# EAGLE design simon-7segment (EAGLE 7.6.0)
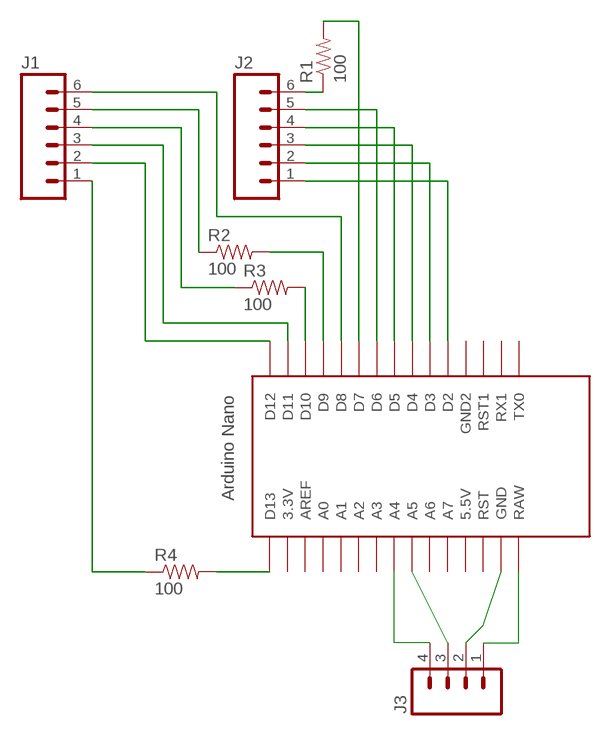
[diagram p0: schematic, sheet 1]

## Parts
J1  M06SILK_FEMALE_PTH  [1X06]
J2  M06SILK_FEMALE_PTH  [1X06]
J3  M04LOCK_LONGPADS  [1X04_LOCK_LONGPADS]
R1  100  RESISTORPTH-1/4W  [AXIAL-0.4]
R2  100  RESISTORPTH-1/4W  [AXIAL-0.4]
R3  100  RESISTORPTH-1/4W  [AXIAL-0.4]
R4  100  RESISTORPTH-1/4W  [AXIAL-0.4]
U$1  NANO  [NANO]

## Nets
5V: J3.1 U$1.RAW
12: J1.1 R4.P$1
GND: J3.2 U$1.GND
N$1: J2.1 U$1.D2
N$2: J2.2 U$1.D3
N$3: J2.3 U$1.D4
N$4: J2.4 U$1.D5
N$5: J2.5 U$1.D6
N$6: J2.6 R1.P$1
N$7: R1.P$2 U$1.D7
N$8: J1.6 U$1.D8
N$9: J1.5 R2.P$1
N$10: R2.P$2 U$1.D9
N$11: J1.4 R3.P$1
N$12: R3.P$2 U$1.D10
N$13: J1.3 U$1.D11
N$14: J1.2 U$1.D12
N$16: R4.P$2 U$1.D13
SCL: J3.3 U$1.A5
SDA: J3.4 U$1.A4
Unconnected: U$1.3.3V U$1.5V(5.5V) U$1.A0 U$1.A1 U$1.A2 U$1.A3 U$1.A6 U$1.A7 U$1.AREF U$1.GND1(GND2) U$1.ICSP1 U$1.ICSP2 U$1.ICSP3 U$1.ICSP4 U$1.ICSP5 U$1.ICSP6 U$1.RST U$1.RST1 U$1.RX1 U$1.TX0

## Library data of the parts
J1 J2 = SparkFun-Connectors:M06: Header 6 Standard 6-pin 0.1" header. Use with straight break away headers (SKU : PRT-00116), right angle break away headers (PRT-00553), swiss pins (PRT-00743), machine pins (PRT-00117), and female headers (PRT-00115). Molex polarized connector foot print use with SKU : PRT-08094 with associated crimp pins and housings. NOTES ON THE VARIANTS LOCK and LOCK_LONGPADS... This footprint was designed to help hold the alignment of a through-hole component (i.e. 6-pin header) while soldering it into place. You may notice that each hole has been shifted either up or down by 0.005 of an inch from it's more standard position (which is a perfectly straight line). This slight alteration caused the pins (the squares in the middle) to touch the edges of the holes. Because they are alternating, it causes a "brace" to hold the component in place. 0.005 has proven to be the perfect amount of "off-center" position when using our standard breakaway headers. Although looks a little odd when you look at the bare footprint, once you have a header in there, the alteration is very hard to notice. Also,if you push a header all the way into place, it is covered up entirely on the bottom side. This idea of altering the position of holes to aid alignment will be further integrated into the Sparkfun Library for other footprints. It can help hold any component with 3 or more connection pins.; PROD_ID: CONN-08437
J3 = SparkFun-Connectors:M04: Header 4 Standard 4-pin 0.1" header. Use with straight break away headers (SKU : PRT-00116), right angle break away headers (PRT-00553), swiss pins (PRT-00743), machine pins (PRT-00117), and female headers (PRT-00115). Molex polarized connector foot print use with SKU : PRT-08231 with associated crimp pins and housings. 1MM SMD Version SKU: PRT-10208; PROD_ID: CONN-09696
R1-R4 = SparkFun-Passives:RESISTOR: Resistor Basic schematic elements and footprints for 0603, 1206, and PTH resistors.
U$1 = Arduino-clone:NANO: Arduino Nano

## Board
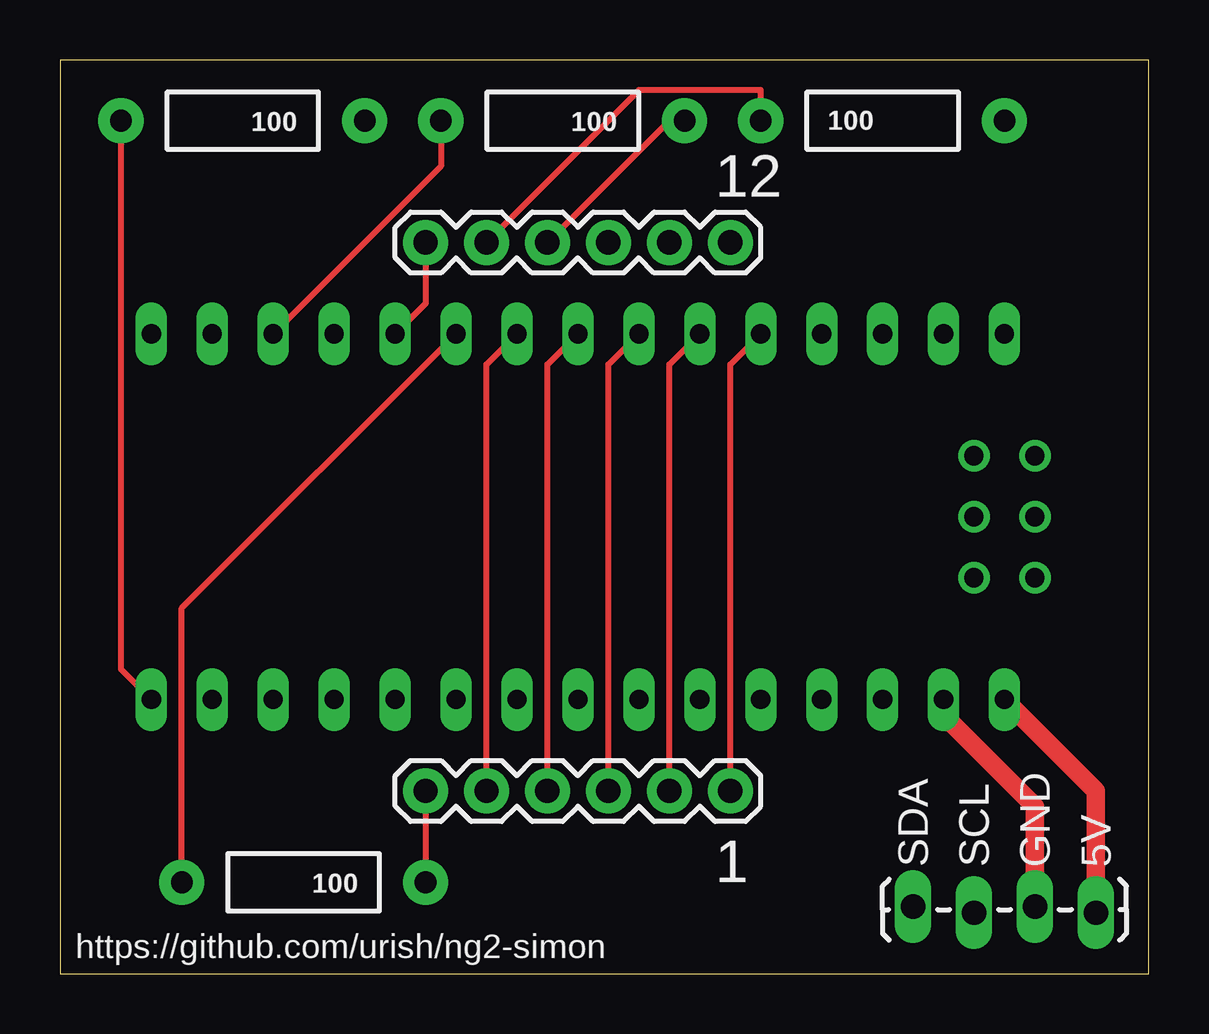
[diagram p1: board, top side]
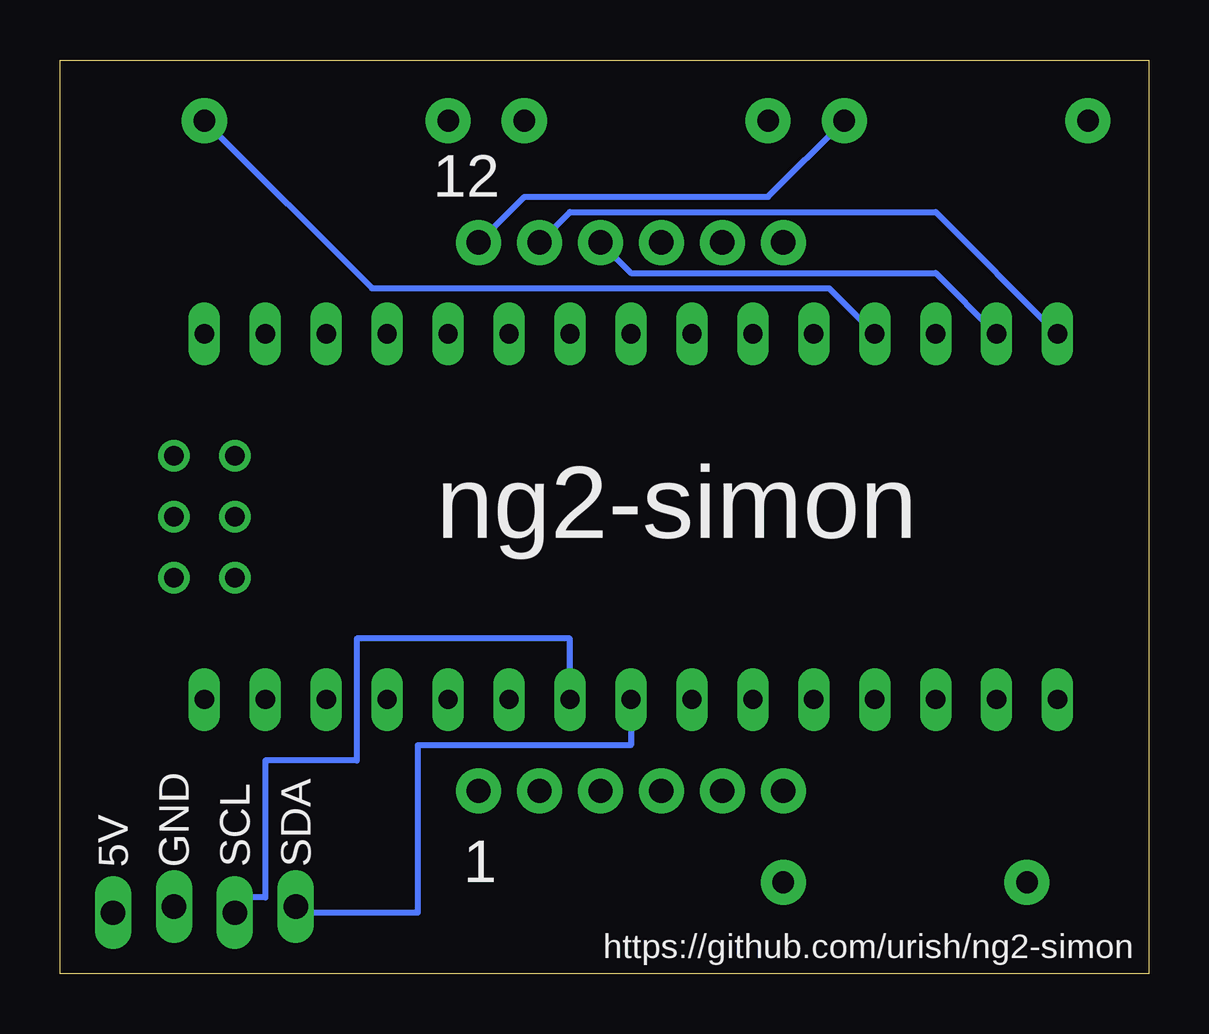
[diagram p2: board, bottom side, seen from below]

Size 45.39 x 38.09 mm. Coordinates in mm from the lower left corner, seen from the top.
Outline: 0,0 45.39,0 45.39,38.09 0,38.09 0,0
Copper layers (1*16): Top 0.035mm / dielectric 1.5mm / Bottom 0.035mm
Design rules "default": minimum track width 10mil, minimum drill 24mil, track to track 8mil, track to pad 8mil, pad to pad 8mil, via to via 8mil, smd to smd 8mil, copper to edge 40mil, drill to drill 8mil, minimum pad ring 10mil, minimum via ring 8mil, stop-mask expansion 4mil, vias tented up to drill 0mil, thermal gap 10mil

### Footprints (pad centres in the part's own frame; a part is rotated, then mirrored left to right if it is on the bottom)
1X06 = drill 1.016 pad 1.88: 1 0,0; 2 2.54,0; 3 5.08,0; 4 7.62,0; 5 10.16,0; 6 12.7,0
1X04_LOCK_LONGPADS = drill 1.016 long: 1 0,0; 2 2.54,-0.254; 3 5.08,0; 4 7.62,-0.254
AXIAL-0.4 = drill 0.9 pad 1.88: P$1 -5.08,0; P$2 5.08,0
NANO = drill 0.8 long: 3.3V -10.16,24.13; 5V -10.16,-1.27; A0 -10.16,19.05; A1 -10.16,16.51; A2 -10.16,13.97; A3 -10.16,11.43; A4 -10.16,8.89; A5 -10.16,6.35; A6 -10.16,3.81; A7 -10.16,1.27; AREF -10.16,21.59; D2 5.08,1.27; D3 5.08,3.81; D4 5.08,6.35; D5 5.08,8.89; D6 5.08,11.43; D7 5.08,13.97; D8 5.08,16.51; D9 5.08,19.05; D10 5.08,21.59; D11 5.08,24.13; D12 5.08,26.67; D13 -10.16,26.67; GND -10.16,-6.35; GND1 5.08,-1.27; RAW -10.16,-8.89; RST -10.16,-3.81; RST1 5.08,-3.81; RX1 5.08,-6.35; TX0 5.08,-8.89 | drill 0.8: ICSP1 -5.08,-10.16; ICSP2 -5.08,-7.62; ICSP3 -2.54,-10.16; ICSP4 -2.54,-7.62; ICSP5 0,-10.16; ICSP6 0,-7.62

### Placement (x,y rotation side)
J1  27.94,30.48 180 top
J2  27.94,7.62 180 top
J3  43.18,2.54 180 top
R1  10.16,3.81 180 top
R2  34.29,35.56 0 top
R3  20.95,35.56 180 top
R4  7.62,35.56 180 top
U$1  30.48,21.59 90 top

### Tracks (layer width: path | path; a pad name or v marks a point on that pad's centre or on a via)
5V
  Top 0.762: U$1.RAW 43.18,7.62 J3.1
12
  Bottom 0.254: R4.P$1 15.88,32.39 26.04,32.39 J1.1
GND
  Top 0.762: U$1.GND 36.83,10.8 40.64,6.98 J3.2
N$1
  Top 0.254: U$1.D2 27.94,25.4 J2.1
N$2
  Top 0.254: U$1.D3 25.4,25.4 J2.2
N$3
  Top 0.254: U$1.D4 22.86,25.4 J2.3
N$4
  Top 0.254: U$1.D5 20.32,25.4 J2.4
N$5
  Top 0.254: U$1.D6 17.78,25.4 J2.5
N$6
  Top 0.254: J2.6 R1.P$1
N$7
  Top 0.254: U$1.D7 5.08,15.24 R1.P$2
N$8
  Top 0.254: U$1.D8 15.24,27.94 J1.6
N$9
  Top 0.254: J1.5 24.13,36.83 29.21,36.83 R2.P$1
N$10
  Bottom 0.254: U$1.D9 13.34,28.58 32.38,28.58 R2.P$2
N$11
  Top 0.254: J1.4 25.4,35.56 R3.P$1
N$12
  Top 0.254: U$1.D10 15.88,33.66 R3.P$2
N$13
  Bottom 0.254: U$1.D11 8.89,29.21 21.59,29.21 J1.3
N$14
  Bottom 0.254: U$1.D12 8.89,31.75 24.13,31.75 J1.2
N$16
  Top 0.254: U$1.D13 2.54,12.7 R4.P$2
SCL
  Bottom 0.254: U$1.A5 24.13,13.97 33.02,13.97 33.02,8.89 36.83,8.89 36.83,3.17 38.1,3.17 J3.3
SDA
  Bottom 0.254: U$1.A4 21.59,9.52 30.48,9.52 30.48,2.54 35.56,2.54 J3.4

### Text on the board
bPlace: ng2-simon
tNames: 12 | 1 | SDA | SCL | GND | 5V | https://github.com/urish/ng2-simon
bNames: 12 | 1 | SDA | SCL | GND | 5V | https://github.com/urish/ng2-simon